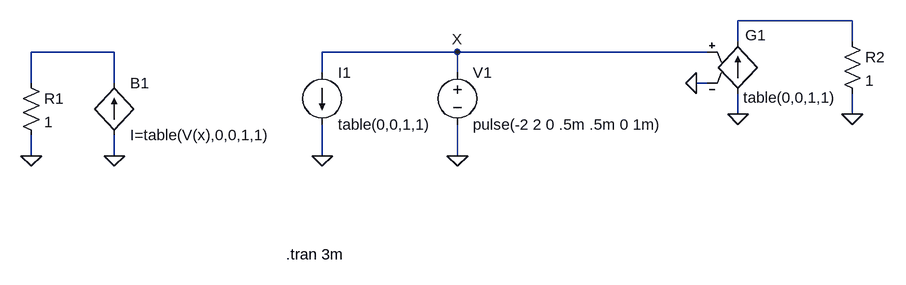
[diagram p0: schematic b2.asc]
b2.asc, the LTspice schematic file:
Version 4
SHEET 1 1160 680
WIRE -144 304 -144 272
WIRE -144 192 -144 144
WIRE -144 144 -272 144
WIRE -272 144 -272 192
WIRE -272 272 -272 304
WIRE 384 144 384 176
WIRE 384 256 384 304
WIRE 816 240 816 208
WIRE 816 128 816 96
WIRE 816 96 992 96
WIRE 992 96 992 128
WIRE 752 192 768 192
WIRE 768 144 384 144
WIRE 992 208 992 240
WIRE 176 304 176 256
WIRE 176 176 176 144
WIRE 176 144 384 144
FLAG -272 304 0
FLAG -144 304 0
FLAG 384 304 0
FLAG 384 144 X
FLAG 992 240 0
FLAG 816 240 0
FLAG 752 192 0
FLAG 176 304 0
SYMBOL bi2 -144 192 R0
SYMATTR InstName B1
SYMATTR Value I=table(V(x),0,0,1,1)
SYMBOL res -288 176 R0
SYMATTR InstName R1
SYMATTR Value 1
SYMBOL voltage 384 160 R0
SYMATTR InstName V1
SYMATTR Value pulse(-2 2 0 .5m .5m 0 1m)
SYMBOL g 816 112 R0
WINDOW 0 11 6 Left 0
WINDOW 3 8 102 Left 0
SYMATTR InstName G1
SYMATTR Value table(0,0,1,1)
SYMBOL res 976 112 R0
SYMATTR InstName R2
SYMATTR Value 1
SYMBOL current 176 176 R0
SYMATTR InstName I1
SYMATTR Value table(0,0,1,1)
TEXT 120 456 Left 0 !.tran 3m

The netlist it stands for:
* b2.asc
B1 0 N001 I=table(V(x),0,0,1,1)
R1 N001 0 1
V1 X 0 pulse(-2 2 0 .5m .5m 0 1m)
G1 0 N002 X 0 table(0,0,1,1)
R2 N002 0 1
I1 X 0 table(0,0,1,1)
.tran 3m
.backanno
.end